# Altium schematic sheet Sheet1.SchDoc
size A; SheetNumber: 1; SheetTotal: 1
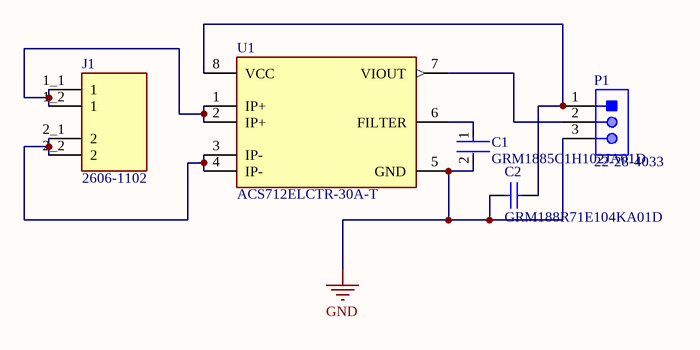
[diagram p0: Sheet1.SchDoc]

## Parts
C1  GRM1885C1H102JA01D  [FP-GRM188-0_1-e0_2_0_5-IPC_C]
C2  GRM188R71E104KA01D  [CAPC1608X90X35LL10T15]
J1  2606-1102  [WAGO_2606-1102]
P1  22-28-4033  [MOLX-22-28-4033_V]
U1  ACS712ELCTR-30A-T  [FP-LC-8-IPC_C]

## Nets
GND: C1.2 C2.1 P1.3 U1.5(GND)
NetC1_1: C1.1 U1.6(FILTER)
NetC2_2: C2.2 P1.1 U1.8(VCC)
NetJ1_1_1: J1.1_1(1) J1.1_2(1) U1.1(IP+) U1.2(IP+)
NetJ1_2_1: J1.2_1(2) J1.2_2(2) U1.3(IP-) U1.4(IP-)
NetP1_2: P1.2 U1.7(VIOUT)

## Library data of the parts
C1 = CMP-1662-00022-2: Chip Multilayer Ceramic Capacitors for General Purpose, 0603, 1000pF, C0G, 30ppm/°C, 5%, 50V; Insulation Resistance: 10GR; Capacitance: 1nF; Number of Pins: 2; REACH SVHC: No SVHC; Width: 0.8mm; Tolerance: 5%; Termination: SMD/SMT; Thickness: 0.035inch; Height: 0.8mm; Case Code (Imperial): 0603; Length: 1.6mm; Voltage Rating: 50V; Voltage Rating (DC): 50V; Temperature Coefficient: 30ppm/°C; Mount: Surface Mount; Lead Free: Lead Free; Max Operating Temperature: 125°C; Min Operating Temperature: -55°C; Packaging: Tape and Reel; Dielectric: C0G; Voltage: 50V; Package Quantity: 1; Material: Ceramic; Case Code (Metric): 1608; Radiation Hardening: No; Depth: 0.8mm; Case/Package: 0603; Dielectric Material: Ceramic
C2 = CMP-2006-02868-1: Manufacturer: Murata; Part Number: GRM188R71E104KA01D
J1 = 2606-1102: 2 Position Wire to Board Terminal Block Horizontal with Board 0.295 (7.50mm) Through Hole; MF: WAGO; SnapEDA_Link: https://www.snapeda.com/parts/2606-1102/WAGO/view-part/?ref=snap; Package: None; Value: *; MP: 2606-1102; Check_prices: https://www.snapeda.com/parts/2606-1102/WAGO/view-part/?ref=eda
P1 = CMP-1676-00001-5: Male Header, Pitch 2.54 mm, 1 x 3 Position, Height 8.38 mm, Tail Length 3.18 mm, RoHS, Bulk; Manufacturer: Molex; Rows: 1; Voltage Rating: 250 V; Current Rating: 4 A; Min Operating Temperature: 0 degC; Lead Pitch: 0.1 inch; Packaging: Bulk; Contact Finish: Gold; RoHSCompliant: true; Contact Material: Brass; PackageReference: 22-28-4033; REACH SVHC: Unknown; PackageDescription: Male Header, Pitch 2.54 mm, 1 x 3 Position, Height 8.38 mm, Tail Length 3.18 mm; ComponentLink2URL: http://www.molex.com/pdm_docs/sd/022284033_sd.pdf; Height: 8.38 mm; Mounting Technology: Through Hole; ComponentLink1Description: Manufacturer URL; Length: 7.62 mm; Mount: Through Hole; DatasheetVersion: Rev. G, 01/2012; Max Operating Temperature: 75 degC; ComponentLink2Description: Datasheet; Colour: Black; Pins: 3; Contact Plating: Gold; Package Quantity: 1; ComponentLink1URL: http://www.molex.com/
U1 = CMP-2000-04990-2: SENSOR CURRENT HALL 30A AC/DC; Bandwidth: 80kHz; Max Supply Current: 13mA; Linearity: 1.5%; Operating Supply Voltage: 5V; Quiescent Current: 10mA; Number of Channels: 1; Polarity: Bidirectional; Min Supply Voltage: 4.5V; Response Time: 5us; Sensitivity: 66mV/A; Max Supply Voltage: 5.5V; Current Sensing: 30A; REACH SVHC: No SVHC; Mount: Surface Mount; Max Operating Temperature: 85°C; Packaging: Cut Tape; Frequency: 80kHz; Series: -; Termination: SMD/SMT; RoHS Compliant: Yes; Number of Pins: 8; Package Quantity: 1; Accuracy: 1.5%; Lead Free: Lead Free; Case/Package: SOIC; Min Operating Temperature: -40°C; Output Current: 10mA